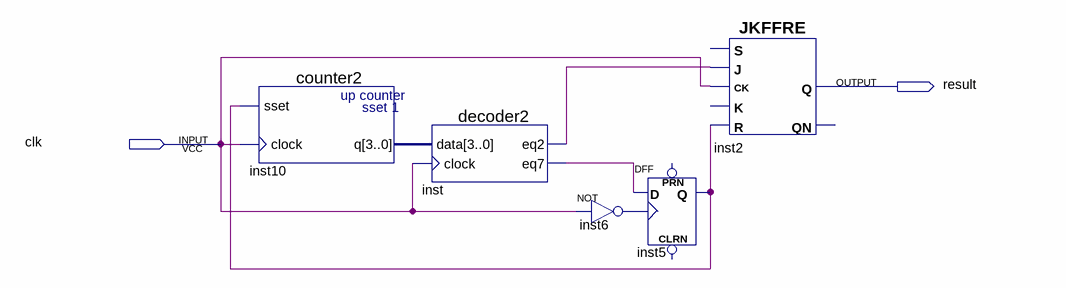
[diagram p0: schematic sheet]
// Quartus schematic Block2.bdf as structural Verilog: 5 symbols, 2 pins
module Block2 (
  input  clk,
  output result
);

  wire inst5_q, inst6_out, inst_eq2, inst_eq7;
  wire [3:0] inst10_q;

  counter2 inst10 (.sset(inst5_q), .clock(clk), .q(inst10_q));
  decoder2 inst (.data(inst10_q), .clock(clk), .eq2(inst_eq2), .eq7(inst_eq7));
  not inst6 (inst6_out, clk);
  DFF inst5 (.CLK(inst6_out), .D(inst_eq7), .Q(inst5_q));  // open: CLRN, PRN
  JKFFRE inst2 (.R(inst5_q), .CK(clk), .J(inst_eq2), .Q(result));  // open: K, S, QN
endmodule
